# Altium schematic sheet Logic_Outputs.SchDoc: Vacuum chamber sensorboard - Control outputs
size A4; SheetNumber: 4; SheetTotal: 6
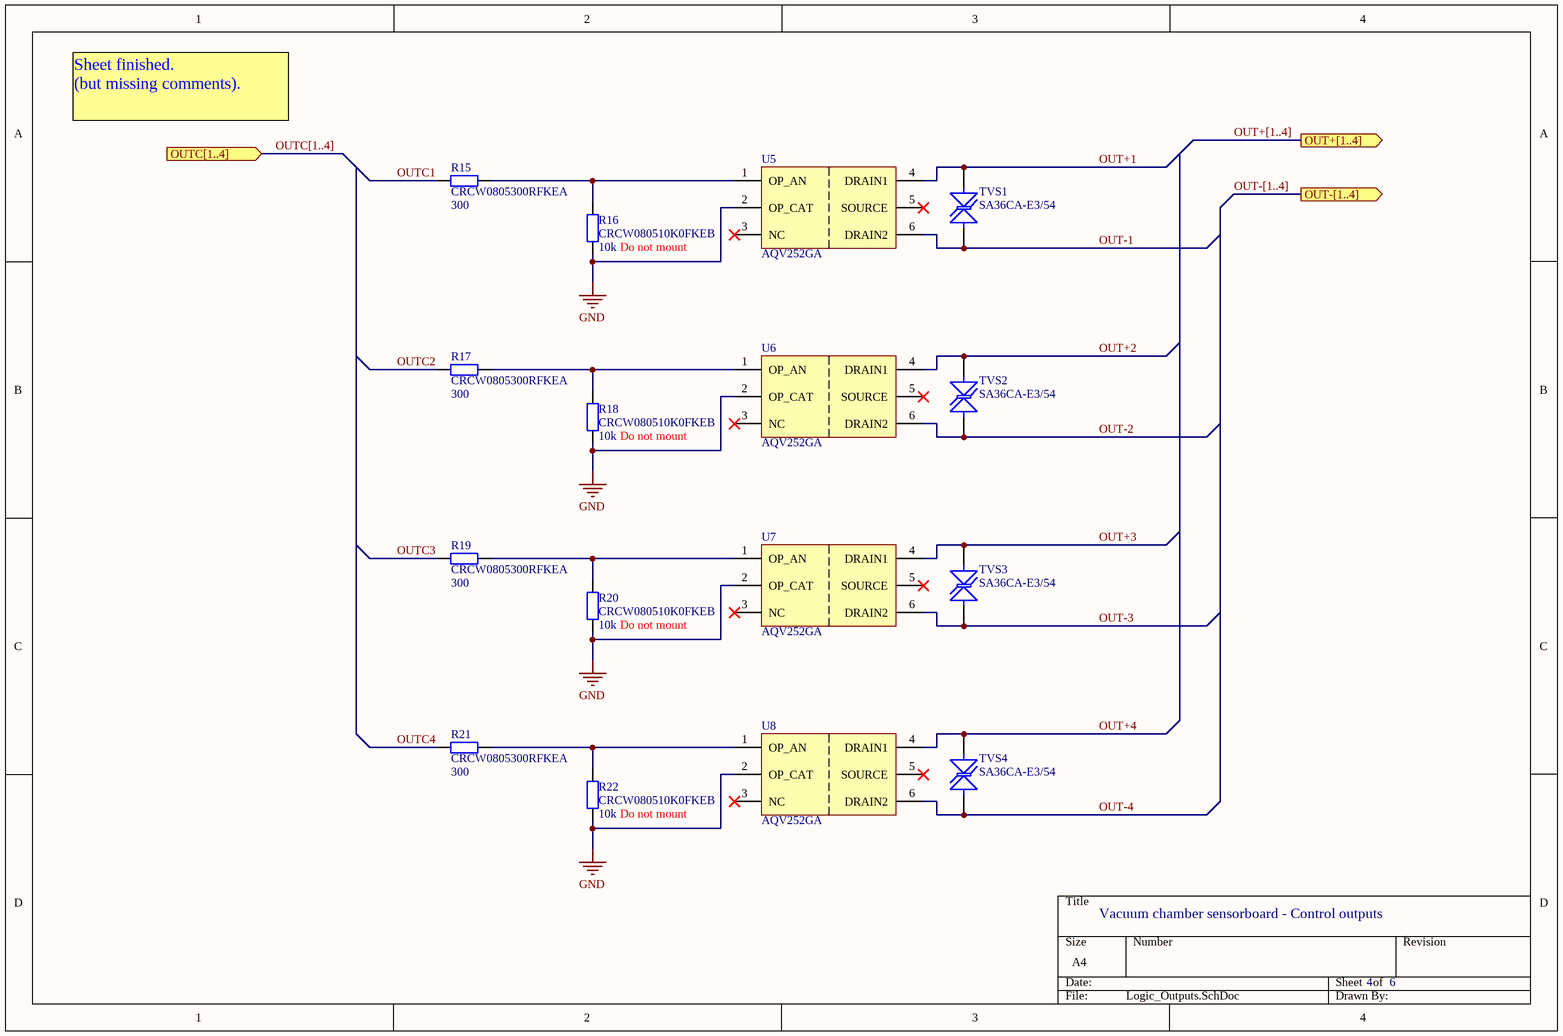
[diagram p0: Logic_Outputs.SchDoc]

## Parts
R15  CRCW0805300RFKEA  value 300  [Res Vishay0805]
R16  CRCW080510K0FKEB  value 10k  [Res Vishay0805]
R17  CRCW0805300RFKEA  value 300  [Res Vishay0805]
R18  CRCW080510K0FKEB  value 10k  [Res Vishay0805]
R19  CRCW0805300RFKEA  value 300  [Res Vishay0805]
R20  CRCW080510K0FKEB  value 10k  [Res Vishay0805]
R21  CRCW0805300RFKEA  value 300  [Res Vishay0805]
R22  CRCW080510K0FKEB  value 10k  [Res Vishay0805]
TVS1  SA36CA-E3/54  [Diode Vishay]
TVS2  SA36CA-E3/54  [Diode Vishay]
TVS3  SA36CA-E3/54  [Diode Vishay]
TVS4  SA36CA-E3/54  [Diode Vishay]
U5  AQV252GA  [AQV252GA Panasonic]
U6  AQV252GA  [AQV252GA Panasonic]
U7  AQV252GA  [AQV252GA Panasonic]
U8  AQV252GA  [AQV252GA Panasonic]

## Ports
OUT+[1..4] (out), OUT-[1..4] (out), OUTC[1..4] (in)

## Nets
GND: R16.1 R18.1 R20.1 R22.1 U5.2(OP_CAT) U6.2(OP_CAT) U7.2(OP_CAT) U8.2(OP_CAT)
OUT+1: TVS1.2(K) U5.4(DRAIN1)
OUT+2: TVS2.2(K) U6.4(DRAIN1)
OUT+3: TVS3.2(K) U7.4(DRAIN1)
OUT+4: TVS4.2(K) U8.4(DRAIN1)
OUT-1: TVS1.1(A) U5.6(DRAIN2)
OUT-2: TVS2.1(A) U6.6(DRAIN2)
OUT-3: TVS3.1(A) U7.6(DRAIN2)
OUT-4: TVS4.1(A) U8.6(DRAIN2)
OUTC1: R15.1
OUTC2: R17.1
OUTC3: R19.1
OUTC4: R21.1
NetR15_2: R15.2 R16.2 U5.1(OP_AN)
NetR17_2: R17.2 R18.2 U6.1(OP_AN)
NetR19_2: R19.2 R20.2 U7.1(OP_AN)
NetR21_2: R21.2 R22.2 U8.1(OP_AN)

Not connected (* = marked no-connect by the designer): U5 3(NC)* 5(SOURCE)*; U6 3(NC)* 5(SOURCE)*; U7 3(NC)* 5(SOURCE)*; U8 3(NC)* 5(SOURCE)*

## Buses and harness runs
bus OUT+[1..4] = port OUT+[1..4]
bus OUT-[1..4] = port OUT-[1..4]
bus OUTC[1..4] = port OUTC[1..4]

## Notes on the sheet
- Sheet finished.
  (but missing comments).
- (near R16) Do not mount
- (near R18) Do not mount
- (near R20) Do not mount
- (near R22) Do not mount

## Library data of the parts
R15 R17 R19 R21 = CRCW0805300RFKEA: Thick film resistor, 1%, 125mW; Manufacturer: Vishay; ComponentLink1Description: Datasheet; ComponentLink1URL: http://www.vishay.com/docs/20035/dcrcwe3.pdf; PackageReference: 0805; Supplier 1: Mouser; Supplier Part Number 1: 71-CRCW0805300RFKEA
R16 R18 R20 R22 = CRCW080510K0FKEB: Thick film resistor, 1%, 125mW; Manufacturer: Vishay; ComponentLink1Description: Datasheet; ComponentLink1URL: http://www.vishay.com/docs/20035/dcrcwe3.pdf; PackageReference: 0805; Supplier 1: Mouser; Supplier Part Number 1: 71-CRCW080510K0FKEB
TVS1-TVS4 = SA36CA-E3/54: TVS diode, bidirectional, 36 V; pin to pad: 1>A 2>K; Manufacturer: Vishay; ComponentLink1Description: Datasheet; ComponentLink1URL: http://www.vishay.com/docs/88378/sa50athrusa170ca.pdf; PackageReference: DO-204AC; Supplier 1: Mouser; Supplier Part Number 1: 625-SA36CA-E3/54
U5-U8 = AQV252GA: Solid state relay, DC/AC, 60V, 2.5A; Manufacturer: Panasonic; PackageReference: SMD-6; ComponentLink1Description: Datasheet; ComponentLink1URL: http://www3.panasonic.biz/ac/e/control/relay/photomos/he/he1a_aqv25_g/index.jsp; Supplier 1: Mouser; Supplier Part Number 1: 769-AQV252GA